# EAGLE schematic distortion+ (EAGLE 9.6.0)
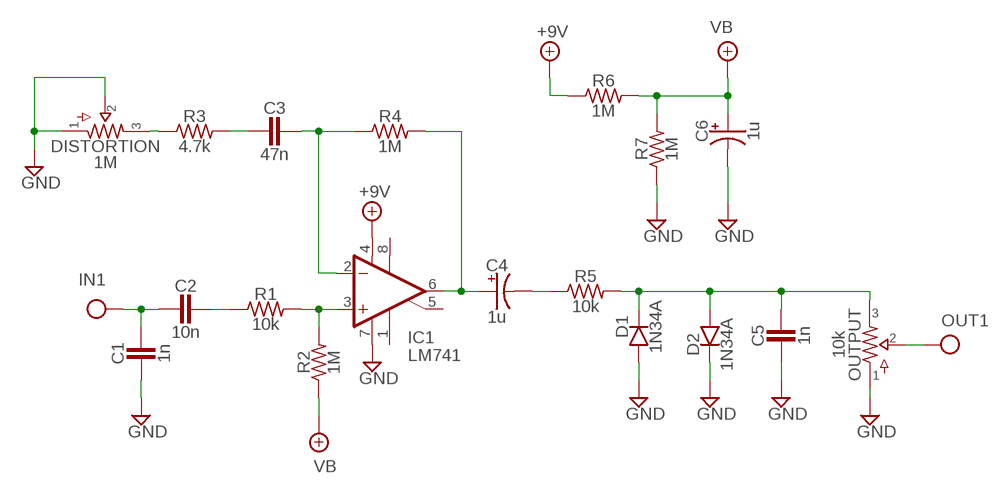
[diagram p0: schematic, sheet 1]

## Parts
C1  1n  CER/FILMBOX.1  [BOX_SMALL]
C2  10n  CER/FILMBOX.1  [BOX_SMALL]
C3  47n  CER/FILMBOX.1  [BOX_SMALL]
C4  1u  0500  [050_020]
C5  1n  CER/FILMBOX.1  [BOX_SMALL]
C6  1u  0500  [050_020]
D1  1N34A  DO41.2  [DO41-2]
D2  1N34A  DO41.2  [DO41-2]
DISTORTION  1M  POTS16MM  [16MM]
IC1  LM741  SINGLETH  [DIL0]
IN1  IN(T)  [SQUARE]
OUTPUT  10k  POTS16MM  [16MM]
R1  10k  R_.3B  [R0207/3]
R2  1M  R_.3B  [R0207/3]
R3  4.7k  R_.3B  [R0207/3]
R4  1M  R_.3B  [R0207/3]
R5  10k  R_.3B  [R0207/3]
R6  1M  R_.3B  [R0207/3]
R7  1M  R_.3B  [R0207/3]

## Nets
+9V: IC1.4(V-) R6.1
GND: C1.2 C5.2 C6.- D1.A D2.C DISTORTION.1 DISTORTION.2 IC1.7(V+) OUTPUT.1 R7.1
IN: C1.1 C2.2 IN1.1(IN)
N$2: C2.1 R1.1
N$3: IC1.3(+IN) R1.2 R2.2
N$4: C3.1 IC1.2(-IN) R4.1
N$5: C3.2 R3.2
N$6: DISTORTION.3 R3.1
N$7: C4.- R5.1
N$8: C5.1 D1.C D2.A OUTPUT.3 R5.2
N$9: C4.+ IC1.6(OUT) R4.2
OUT: OUTPUT.2
VB: C6.+ R2.1 R6.2 R7.2
Unconnected: IC1.1(ON1) IC1.5(ON2) IC1.8(OPT)

## Library data of the parts
C1-C3 C5 = pedals-capacitors-film:CER/FILM: 47 - 120pF Xicon Ceramic Disc 2.5mm lead spacing
C4 C6 = pedals-capacitors-elec:050
D1 D2 = pedals-diodes:DO41: DO-41 Package Diodes: 1N4001 - 1N40019 Zener Diodes: 1N4728 - 1N4764
DISTORTION OUTPUT = pedals-potentiometers:POTS
IC1 = pedals-integrated circuits:SINGLE: OP AMP
IN1 = pedals-supply:IN(T): Input obsolete: use Pad instead and label net shematic input label with circuit board terminal/pad generally used only once on a schematic (because this device labels the net "IN" in the same way as a voltage supply or ground net)
R1-R7 = pedals-resistors:R_